# EAGLE schematic prc1000 (EAGLE 7.7.0)

## Sheet 1 of 2
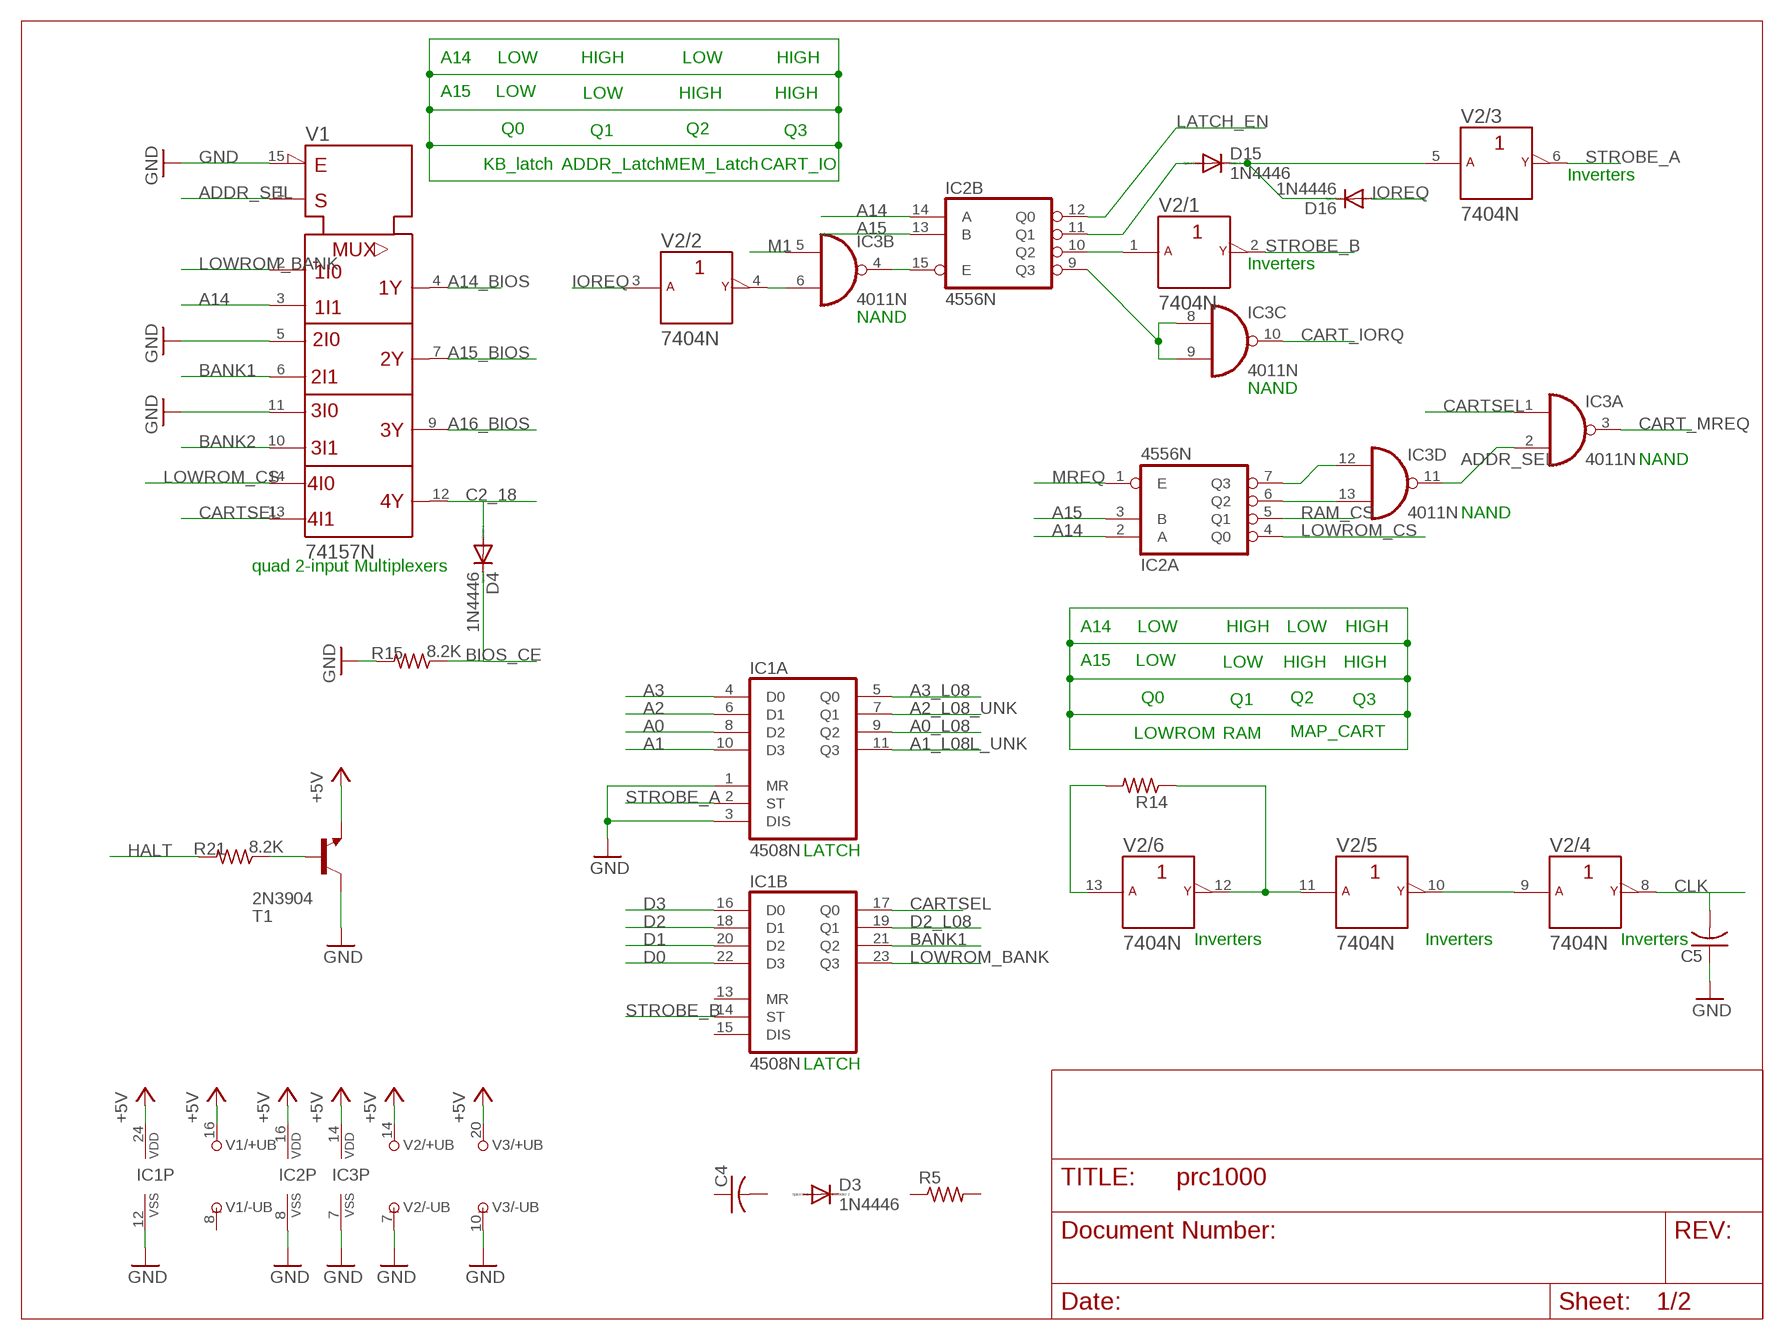
[diagram p0: schematic, sheet 1]

### Parts
C4  C-US050-030X075  [C050-030X075]
C5  C-US050-030X075  [C050-030X075]
D3  1N4446  [DO35-10]
D4  1N4446  [DO35-10]
D15  1N4446  [DO35-10]
D16  1N4446  [DO35-10]
IC1  4508N  [DIL24-6]
IC2  4556N  [DIL16]
IC3  4011N  [DIL14]
R5  R-US_0207/10  [0207/10]
R14  R-US_0207/10  [0207/10]
R15  8.2K  R-US_0207/10  [0207/10]
R21  8.2K  R-US_0207/10  [0207/10]
T1  2N3904  [TO92]
V1  74157N  [DIL16]
V2  7404N  [DIL14]
V3  74244N  [DIL20]

### Nets
+5V: IC1.24(P:VDD) IC2.16(P:VDD) IC3.14(P:VDD) T1.3(E) V1.16(+UB) V2.14(/+UB:+UB) V3.20(/+UB:+UB) ; also sheet 2
A0: IC1.8(A:D2) ; also sheet 2
A0_L08: IC1.9(A:Q2) ; also sheet 2
A1: IC1.10(A:D3) ; also sheet 2
A1_L08L_UNK: IC1.11(A:Q3)
A2: IC1.6(A:D1) ; also sheet 2
A2_L08_UNK: IC1.7(A:Q1)
A3: IC1.4(A:D0) ; also sheet 2
A3_L08: IC1.5(A:Q0)
A14: IC2.2(A:A) IC2.14(B:A) V1.3(1B) ; also sheet 2
A14_BIOS: V1.4(1Y) ; also sheet 2
A15: IC2.3(A:B) IC2.13(B:B) ; also sheet 2
A15_BIOS: V1.7(2Y) ; also sheet 2
A16_BIOS: V1.9(3Y) ; also sheet 2
ADDR_SEL: IC3.2(A:I1) IC3.11(D:O) V1.1(!A!/B)
BANK1: IC1.21(B:Q2) V1.6(2B)
BANK2: V1.10(3B)
BIOS_CE: D4.C R15.1
C2_18: D4.A V1.12(4Y) ; also sheet 2
CART_IORQ: IC3.10(C:O) ; also sheet 2
CART_MREQ: IC3.3(A:O) ; also sheet 2
CARTSEL: IC1.17(B:Q0) IC3.1(A:I0) V1.13(4B)
CLK: C5.2 V2.8(/4:Y) ; also sheet 2
D0: IC1.22(B:D3) ; also sheet 2
D1: IC1.20(B:D2) ; also sheet 2
D2: IC1.18(B:D1) ; also sheet 2
D2_L08: IC1.19(B:Q1)
D3: IC1.16(B:D0) ; also sheet 2
GND: C5.1 IC1.1(A:MR) IC1.3(A:DIS) IC1.12(P:VSS) IC2.8(P:VSS) IC3.7(P:VSS) R15.2 T1.1(C) V1.5(2A) V1.11(3A) V1.15(!G) V2.7(/-UB:-UB) V3.10(/-UB:-UB) ; also sheet 2
HALT: R21.2 ; also sheet 2
IOREQ: D16.A V2.3(/2:A) ; also sheet 2
LATCH_EN: IC2.12(B:Q0) ; also sheet 2
LOWROM_BANK: IC1.23(B:Q3) V1.2(1A)
LOWROM_CS: IC2.4(A:Q0) V1.14(4A)
M1: IC3.5(B:I0) ; also sheet 2
MREQ: IC2.1(A:E) ; also sheet 2
N$7: R21.1 T1.2(B)
N$15: R14.1 V2.11(/5:A) V2.12(/6:Y)
N$16: V2.9(/4:A) V2.10(/5:Y)
N$17: IC3.6(B:I1) V2.4(/2:Y)
N$18: IC2.15(B:E) IC3.4(B:O)
N$25: IC2.9(B:Q3) IC3.8(C:I0) IC3.9(C:I1)
N$35: IC2.7(A:Q3) IC3.12(D:I0)
N$36: IC2.6(A:Q2) IC3.13(D:I1)
N$44: R14.2 V2.13(/6:A)
N$49: IC2.10(B:Q2) V2.1(/1:A)
N$50: D15.C D16.C V2.5(/3:A)
N$53: D15.A IC2.11(B:Q1)
RAM_CS: IC2.5(A:Q1) ; also sheet 2
STROBE_A: IC1.2(A:ST) V2.6(/3:Y)
STROBE_B: IC1.14(B:ST) V2.2(/1:Y)
Unconnected: C4.1 C4.2 D3.A D3.C IC1.13(B:MR) IC1.15(B:DIS) R5.1 R5.2

### Notes on the sheet
- A14 | LOW | HIGH | LOW | HIGH
- A15 | LOW | LOW | HIGH | HIGH
- Q0 | Q1 | Q2 | Q3
- KB_latch | ADDR_Latch | MEM_Latch | CART_IO
- Inverters
- Inverters
- NAND
- NAND
- NAND
- NAND
- quad 2-input Multiplexers
- A14 | LOW | HIGH | LOW | HIGH
- A15 | LOW | LOW | HIGH | HIGH
- Q0 | Q1 | Q2 | Q3
- LOWROM | RAM | MAP_CART
- LATCH
- Inverters | Inverters | Inverters
- LATCH

## Sheet 2 of 2
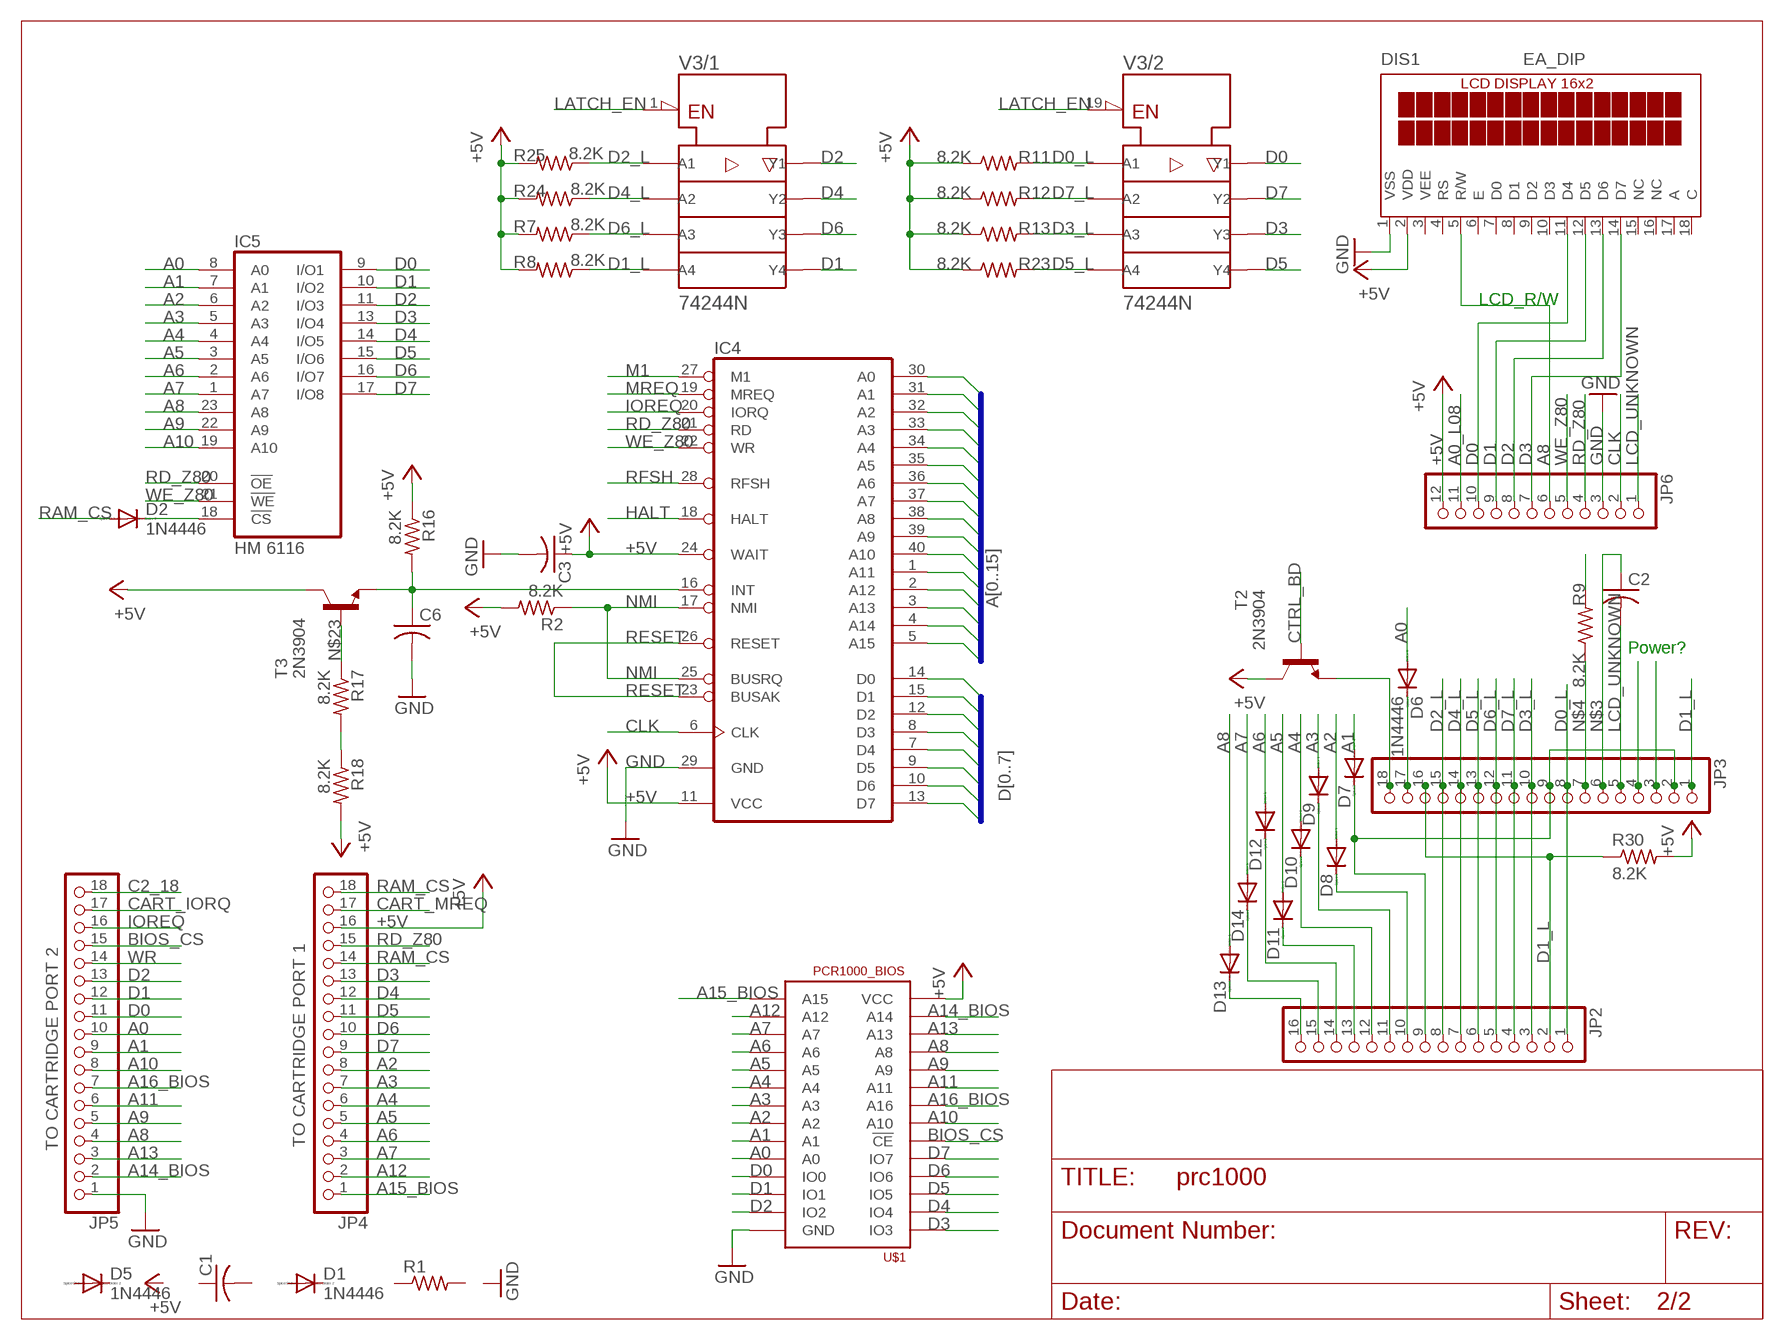
[diagram p1: schematic, sheet 2]

### Parts
C1  C-US050-030X075  [C050-030X075]
C2  C-US050-030X075  [C050-030X075]
C3  C-US050-030X075  [C050-030X075]
C6  C-US050-030X075  [C050-030X075]
D1  1N4446  [DO35-10]
D2  1N4446  [DO35-10]
D5  1N4446  [DO35-10]
D6  1N4446  [DO35-10]
D7  1N4446  [DO35-10]
D8  1N4446  [DO35-10]
D9  1N4446  [DO35-10]
D10  1N4446  [DO35-10]
D11  1N4446  [DO35-10]
D12  1N4446  [DO35-10]
D13  1N4446  [DO35-10]
D14  1N4446  [DO35-10]
DIS1  EA_DIP  [EA_DIP]
IC4  Z80CPU  [DIL40]
IC5  HM 6116  6116P  [DIL24-6]
JP2  PINHD-1X16  [1X16]
JP3  PINHD-1X18  [1X18]
JP4  TO CARTRIDGE PORT 1  PINHD-1X18  [1X18]
JP5  TO CARTRIDGE PORT 2  PINHD-1X18  [1X18]
JP6  PINHD-1X12  [1X12]
R1  R-US_0207/10  [0207/10]
R2  8.2K  R-US_0207/10  [0207/10]
R7  8.2K  R-US_0207/10  [0207/10]
R8  8.2K  R-US_0207/10  [0207/10]
R9  8.2K  R-US_0207/10  [0207/10]
R11  8.2K  R-US_0207/10  [0207/10]
R12  8.2K  R-US_0207/10  [0207/10]
R13  8.2K  R-US_0207/10  [0207/10]
R16  8.2K  R-US_0207/10  [0207/10]
R17  8.2K  R-US_0207/10  [0207/10]
R18  8.2K  R-US_0207/10  [0207/10]
R23  8.2K  R-US_0207/10  [0207/10]
R24  8.2K  R-US_0207/10  [0207/10]
R25  8.2K  R-US_0207/10  [0207/10]
R30  8.2K  R-US_0207/10  [0207/10]
T2  2N3904  [TO92]
T3  2N3904  [TO92]
U$1  PCR1000_BIOS  [DIL28-6]

### Nets
+5V: C3.1 DIS1.2(VDD) IC4.11(VCC) IC4.24(WAIT) JP4.16 JP6.12 R2.2 R7.2 R8.2 R11.1 R12.1 R13.1 R16.1 R18.2 R23.1 R24.2 R25.2 R30.2 T2.1(C) T3.1(C) U$1.28(VCC) ; also sheet 1
A0: D6.A IC4.30(A0) IC5.8(A0) JP5.10 U$1.10(A0) ; also sheet 1
A0_L08: JP6.11 ; also sheet 1
A1: D7.A IC4.31(A1) IC5.7(A1) JP5.9 U$1.9(A1) ; also sheet 1
A2: D8.A IC4.32(A2) IC5.6(A2) JP4.8 U$1.8(A2) ; also sheet 1
A2_D: D8.C JP2.10
A3: D9.A IC4.33(A3) IC5.5(A3) JP4.7 U$1.7(A3) ; also sheet 1
A4: D10.A IC4.34(A4) IC5.4(A4) JP4.6 U$1.6(A4)
A5: D11.A IC4.35(A5) IC5.3(A5) JP4.5 U$1.5(A5)
A6: D12.A IC4.36(A6) IC5.2(A6) JP4.4 U$1.4(A6)
A7: D14.A IC4.37(A7) IC5.1(A7) JP4.3 U$1.3(A7)
A8: D13.A DIS1.5(R/W) IC4.38(A8) IC5.23(A8) JP5.4 JP6.6 U$1.25(A8)
A9: IC4.39(A9) IC5.22(A9) JP5.5 U$1.24(A9)
A10: IC4.40(A10) IC5.19(A10) JP5.8 U$1.21(A10)
A11: IC4.1(A11) JP5.6 U$1.23(A11)
A12: IC4.2(A12) JP4.2 U$1.2(A12)
A13: IC4.3(A13) JP5.3 U$1.26(A13)
A14: IC4.4(A14) ; also sheet 1
A14_BIOS: JP5.2 U$1.27(A14) ; also sheet 1
A15: IC4.5(A15) ; also sheet 1
A15_BIOS: JP4.1 U$1.1(A15) ; also sheet 1
A16_BIOS: JP5.7 U$1.22(A16) ; also sheet 1
BIOS_CS: JP5.15 U$1.20(!CE)
C2_18: JP5.18 ; also sheet 1
CART_IORQ: JP5.17 ; also sheet 1
CART_MREQ: JP4.17 ; also sheet 1
CLK: IC4.6(CLK) JP6.2 ; also sheet 1
CTRL_BD: T2.2(B)
D0: DIS1.11(D4) IC4.14(D0) IC5.9(I/O1) JP5.11 JP6.10 U$1.11(IO0) V3.9(/2:Y1) ; also sheet 1
D0_L: JP2.1 JP3.8 R11.2 V3.11(/2:A1)
D1: DIS1.12(D5) IC4.15(D1) IC5.10(I/O2) JP5.12 JP6.9 U$1.12(IO1) V3.12(/1:Y4) ; also sheet 1
D1_L: JP2.2 JP3.1 JP3.16 R8.1 R30.1 V3.8(/1:A4)
D2: DIS1.13(D6) IC4.12(D2) IC5.11(I/O3) JP5.13 JP6.8 U$1.13(IO2) V3.18(/1:Y1) ; also sheet 1
D2_L: JP2.8 JP3.15 R25.1 V3.2(/1:A1)
D3: DIS1.14(D7) IC4.8(D3) IC5.13(I/O4) JP4.13 JP6.7 U$1.15(IO3) V3.5(/2:Y3) ; also sheet 1
D3_L: JP2.3 JP3.10 R13.2 V3.15(/2:A3)
D4: IC4.7(D4) IC5.14(I/O5) JP4.12 U$1.16(IO4) V3.16(/1:Y2)
D4_L: JP2.7 JP3.14 R24.1 V3.4(/1:A2)
D5: IC4.9(D5) IC5.15(I/O6) JP4.11 U$1.17(IO5) V3.3(/2:Y4)
D5_L: JP2.6 JP3.13 R23.2 V3.17(/2:A4)
D6: IC4.10(D6) IC5.16(I/O7) JP4.10 U$1.18(IO6) V3.14(/1:Y3)
D6_L: JP2.5 JP3.12 R7.1 V3.6(/1:A3)
D7: IC4.13(D7) IC5.17(I/O8) JP4.9 U$1.19(IO7) V3.7(/2:Y2)
D7_L: JP2.4 JP3.11 R12.2 V3.13(/2:A2)
GND: C3.2 C6.2 DIS1.1(VSS) IC4.29(GND) JP5.1 JP6.3 U$1.14(GND) ; also sheet 1
HALT: IC4.18(HALT) ; also sheet 1
IOREQ: IC4.20(IORQ) JP5.16 ; also sheet 1
LATCH_EN: V3.1(/1:!G) V3.19(/2:!G) ; also sheet 1
LCD_UNKNOWN: C2.2 JP3.5 JP6.1
M1: IC4.27(M1) ; also sheet 1
MREQ: IC4.19(MREQ) ; also sheet 1
N$1: JP3.18 T2.3(E)
N$2: JP3.4
N$3: C2.1 JP3.6
N$4: JP3.7 R9.1
N$5: JP3.3
N$6: R9.2
N$8: D6.C JP3.17
N$9: D7.C JP2.9 JP3.2 JP3.9
N$10: D13.C JP2.16
N$11: R17.2 R18.1
N$12: D9.C JP2.11
N$13: D10.C JP2.12
N$14: D2.C IC5.18(!CS)
N$19: D11.C JP2.13
N$20: D12.C JP2.14
N$21: D14.C JP2.15
N$22: C6.1 IC4.16(INT) R16.2 T3.3(E)
N$23: R17.1 T3.2(B)
NMI: IC4.17(NMI) IC4.25(BUSRQ) R2.1
RAM_CS: D2.A JP4.14 JP4.18 ; also sheet 1
RD_Z80: IC4.21(RD) IC5.20(!OE) JP4.15 JP6.4
RESET: IC4.23(BUSAK) IC4.26(RESET)
RFSH: IC4.28(RFSH)
WE_Z80: IC4.22(WR) IC5.21(!WE) JP6.5
WR: JP5.14
Unconnected: C1.1 C1.2 D1.A D1.C D5.A D5.C DIS1.4(RS) DIS1.6(E) DIS1.7(D0) DIS1.8(D1) DIS1.9(D2) DIS1.10(D3) DIS1.15(NC) DIS1.16(NC) DIS1.17(A) DIS1.18(C) R1.1 R1.2

### Buses
D[0..7]
A[0..15]

### Notes on the sheet
- LCD_R/W
- Power?

## Power pins joined to a net without a drawn wire
-UB: V1.8(-UB)
GND: IC5.12(GND)
VCC: IC5.24(VCC)
VEE: DIS1.3(VEE)

## Library data of the parts
C1-C6 = resistor:C-US: CAPACITOR, American symbol
D1-D16 = diode:1N4446: DIODE high speed (Philips)
DIS1 = display-lcd:EA_DIP: LCD-MODUL 2x16 - 6,68mm, INKL. KONTROLLER HD44780 Source: Data sheet <http://www.lcd-module.de/pdf/doma/dip162-d.pdf>
IC1 = 45xx:4508: Dual 4-bit LATCH
IC2 = 45xx:4556: Dual binary 1 of 4 DECODER INVERTER
IC3 = 40xx:4011: Quad 2-input NAND
IC4 = zilog:Z80CPU: Z80 FAMILY DEVICE
IC5 = memory-idt:6116P: MEMORY; OC_FARNELL: unknown; OC_NEWARK: unknown
JP2 = pinhead:PINHD-1X16: PIN HEADER
JP3-JP5 = pinhead:PINHD-1X18: PIN HEADER
JP6 = pinhead:PINHD-1X12: PIN HEADER
R1 R2 R5 R7-R9 R11-R18 R21 R23-R25 R30 = resistor:R-US_: RESISTOR, American symbol
T1-T3 = transistor:2N3904: NPN TRANSISTOR
U$1 = pcr1000:PCR1000_BIOS
V1 = 74ttl-din:74*157: Quadruple 2-line to 1-line data SELECTOR/MULTIPLEXER
V2 = 74ttl-din:74*04: Hex INVERTER
V3 = 74ttl-din:74*244: Octal BUFFER and LINE DRIVER, 3-state